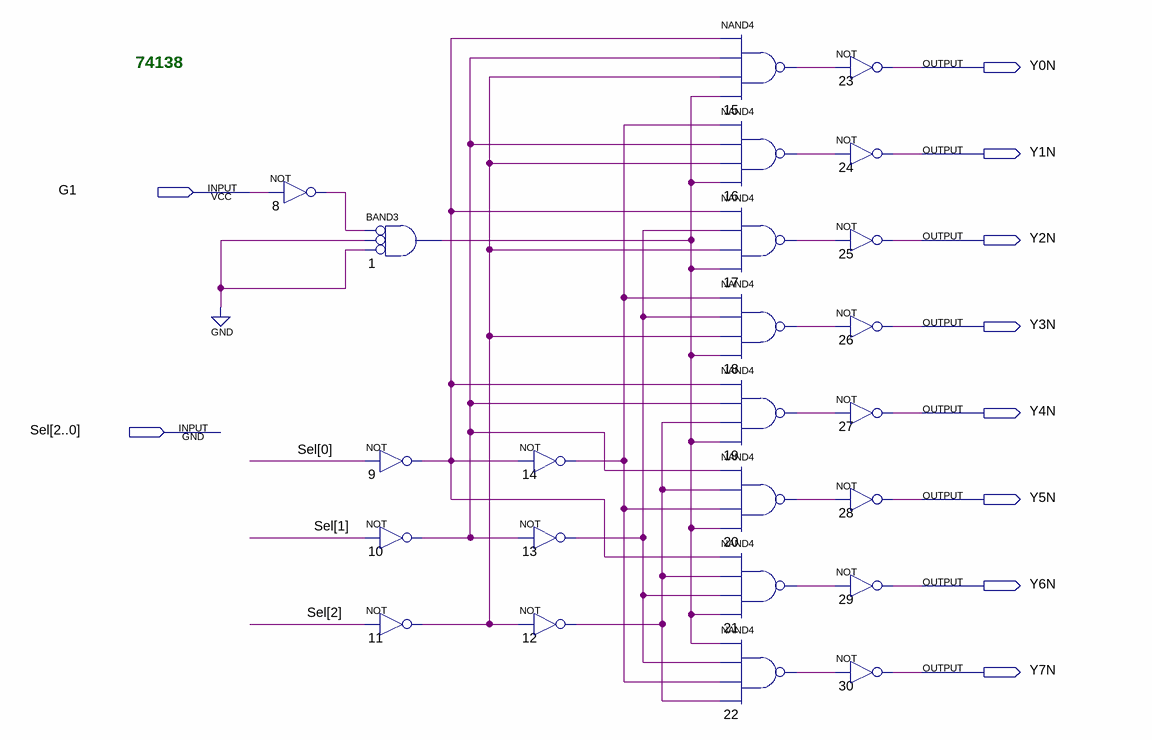
[diagram p0: schematic sheet]
// Quartus schematic DemuxReal1a8.bdf as structural Verilog: 24 symbols, 10 pins
module DemuxReal1a8 (
  input  G1,
  input  [2:0] Sel,
  output Y0N,
  output Y1N,
  output Y2N,
  output Y3N,
  output Y4N,
  output Y5N,
  output Y6N,
  output Y7N
);

  wire n1_out, n8_out, n9_out, n10_out, n11_out, n12_out, n13_out, n14_out, n15_out, n16_out, n17_out,
       n18_out, n19_out, n20_out, n21_out, n22_out;

  not u_8 (n8_out, G1);
  and u_1 (n1_out, ~n8_out, ~1'b0, ~1'b0);  // BAND3
  not u_9 (n9_out, Sel[0]);
  not u_10 (n10_out, Sel[1]);
  not u_11 (n11_out, Sel[2]);
  not u_14 (n14_out, n9_out);
  not u_13 (n13_out, n10_out);
  not u_12 (n12_out, n11_out);
  nand u_15 (n15_out, n9_out, n10_out, n11_out, n1_out);
  nand u_16 (n16_out, n14_out, n10_out, n11_out, n1_out);
  nand u_17 (n17_out, n9_out, n13_out, n11_out, n1_out);
  nand u_18 (n18_out, n14_out, n13_out, n11_out, n1_out);
  nand u_19 (n19_out, n9_out, n10_out, n12_out, n1_out);
  nand u_20 (n20_out, n10_out, n12_out, n14_out, n1_out);
  nand u_21 (n21_out, n9_out, n12_out, n13_out, n1_out);
  nand u_22 (n22_out, n1_out, n13_out, n14_out, n12_out);
  not u_23 (Y0N, n15_out);
  not u_24 (Y1N, n16_out);
  not u_25 (Y2N, n17_out);
  not u_26 (Y3N, n18_out);
  not u_27 (Y4N, n19_out);
  not u_28 (Y5N, n20_out);
  not u_29 (Y6N, n21_out);
  not u_30 (Y7N, n22_out);

  // Notes on the sheet:
  //   74138
endmodule
